# Altium project Desafio_Hardware_Firmware_Nathania.PrjPcb
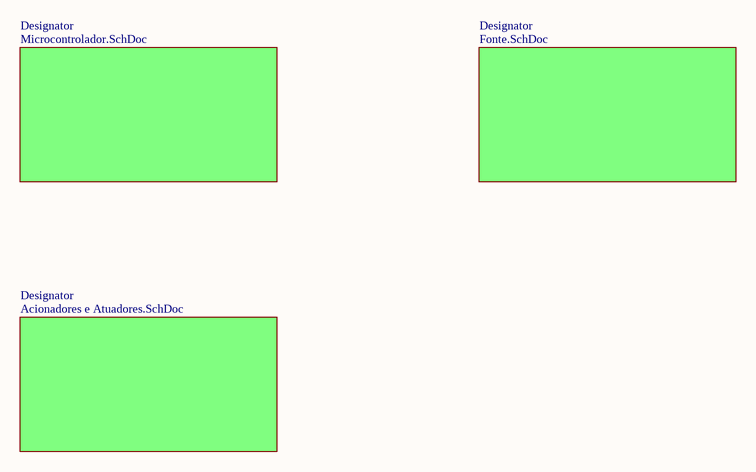
[diagram p0: Main.SchDoc]
4 sheets, 26 parts. Net scope: flat (ports and power ports of the same name join across sheets).
Board file: Desafio_Hardware_Firmware_Nathania.PcbDoc
Sheets:
  Main.SchDoc
    Designator = Microcontrolador.SchDoc
    Designator = Fonte.SchDoc
    Designator = Acionadores e Atuadores.SchDoc

## Sheet Main.SchDoc
size B

### Sub-sheets
Designator = Microcontrolador.SchDoc: no entries
Designator = Fonte.SchDoc: no entries
Designator = Acionadores e Atuadores.SchDoc: no entries

## Sheet Microcontrolador.SchDoc
size B
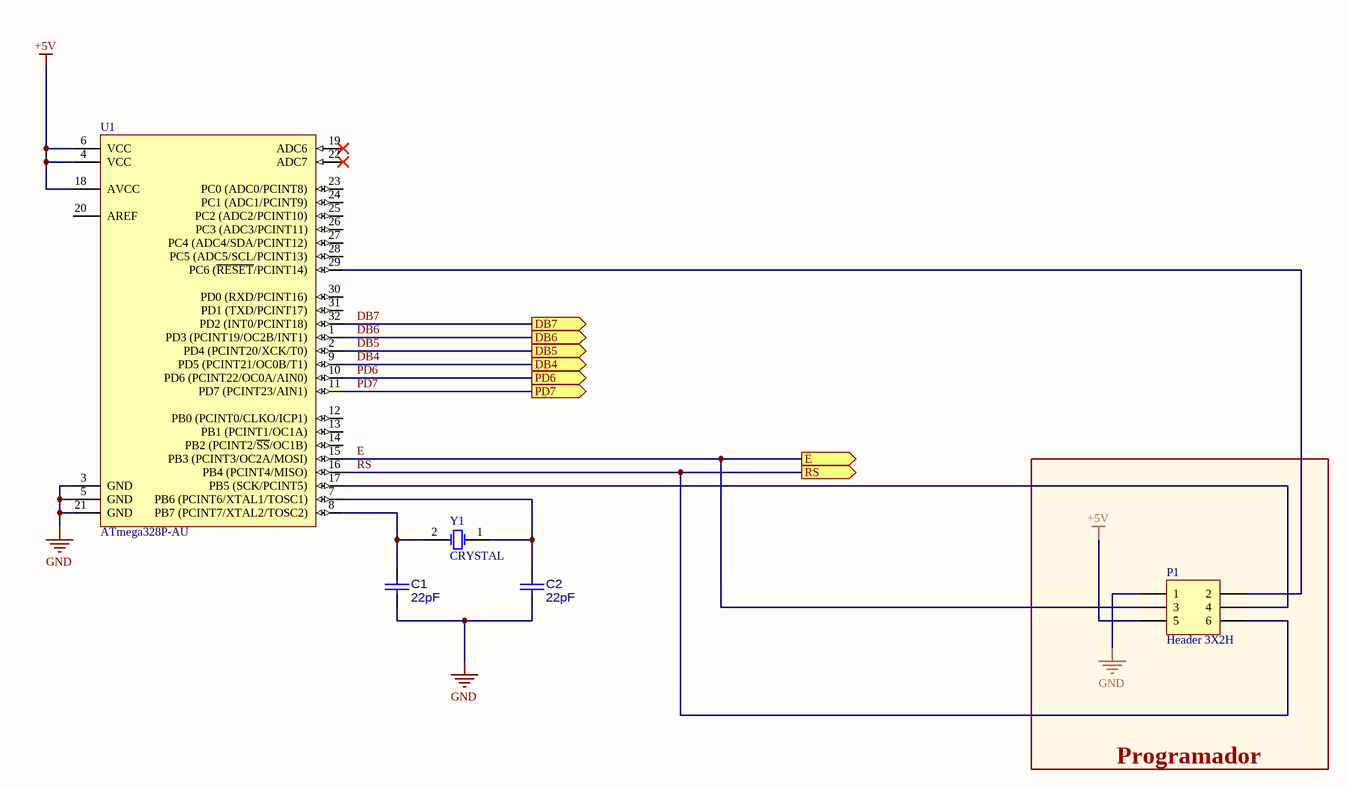
[diagram p1: Microcontrolador.SchDoc]

### Parts
C1  22pF  [CAP0805]
C2  22pF  [CAP0805]
P1  Header 3X2H  [HDR-2X3]
U1  ATmega328P-AU  [32A]
Y1  CRYSTAL  [HC49S-SMD]

### Blocks framed on the sheet
Programador: P1

### Ports
DB4 (out), DB5 (out), DB6 (out), DB7 (out), E (out), PD6 (out), PD7 (out), RS (out)

### Nets
+5V: P1.5 U1.4(VCC) U1.6(VCC) U1.18(AVCC)
GND: C1.2 C2.2 P1.1 U1.3(GND) U1.5(GND) U1.21(GND)
DB4: U1.9(PD5_(PCINT21/OC0B/T1)) ; port DB4
DB5: U1.2(PD4_(PCINT20/XCK/T0)) ; port DB5
DB6: U1.1(PD3_(PCINT19/OC2B/INT1)) ; port DB6
DB7: U1.32(PD2_(INT0/PCINT18)) ; port DB7
E: P1.3 U1.15(PB3_(PCINT3/OC2A/MOSI)) ; port E
PD6: U1.10(PD6_(PCINT22/OC0A/AIN0)) ; port PD6
PD7: U1.11(PD7_(PCINT23/AIN1)) ; port PD7
RS: P1.6 U1.16(PB4_(PCINT4/MISO)) ; port RS
NetC1_1: C1.1 U1.8(PB7_(PCINT7/XTAL2/TOSC2)) Y1.2(OSC2)
NetC2_1: C2.1 U1.7(PB6_(PCINT6/XTAL1/TOSC1)) Y1.1(OSC1)
NetP1_2: P1.2 U1.29(PC6_(~{RESET}/PCINT14))
NetP1_4: P1.4 U1.17(PB5_(SCK/PCINT5))

Not connected (* = marked no-connect by the designer): U1 12(PB0_(PCINT0/CLKO/ICP1)) 13(PB1_(PCINT1/OC1A)) 14(PB2_(PCINT2/~{SS}/OC1B)) 19(ADC6)* 20(AREF) 22(ADC7)* 23(PC0_(ADC0/PCINT8)) 24(PC1_(ADC1/PCINT9)) 25(PC2_(ADC2/PCINT10)) 26(PC3_(ADC3/PCINT11)) 27(PC4_(ADC4/SDA/PCINT12)) 28(PC5_(ADC5/SCL/PCINT13)) 30(PD0_(RXD/PCINT16)) 31(PD1_(TXD/PCINT17))

### Library data of the parts
C1 C2 = CAP_4: Footprint: 0805CAP; Digikey: 1276-1007-1-ND; Value: 22pF
P1 = Header 3X2H: Header, 3-Pin, Dual row, Right Angle; LatestRevisionDate: 17-Jul-2002; LatestRevisionNote: Re-released for DXP Platform.; Publisher: Altium Limited
U1 = ATmega328P-AU: 8-bit AVR Microcontroller, 32KB Flash, 1KB EEPROM, 2KB SRAM, 32-pin TQFP, Industrial Grade (-40°C to 85°C); Published: 1-Apr-2010; DatasheetVersion: revA, Jan-2010; PackageVersion: revB, Oct-2001; PackageReference: 32A; Publisher: Altium Limited; PackageDescription: 32-Lead, 7x7x1.0 mm Body, 0.8mm Lead Pitch, Thin Profile Plastic Quad Flat Package (TQFP); Supplier 1: Digi-Key; Supplier Part Number 1: ATMEGA328P-AU-ND; Supplier 2: Farnell; Supplier Part Number 2: 1715486; Supplier 3: Mouser; Supplier Part Number 3: 556-ATMEGA328P-AU; Code_JEDEC: MS-026-ABA; ComponentLink1Description: Manufacturer Link; ComponentLink1URL: http://www.atmel.com/products/avr/default.asp?; ComponentLink2Description: ATmega48A/48PA/88A/88PA/168A/168PA/328/328P Datasheet; ComponentLink2URL: http://www.atmel.com/dyn/resources/prod_documents/8271.pdf; ComponentLink3Description: ATmega48A/48PA/88A/88PA/168A/168PA/328/328P Summary; ComponentLink3URL: http://www.atmel.com/dyn/resources/prod_documents/8271S.pdf; ComponentLink4Description: Atmel.com Home; ComponentLink4URL: http://www.atmel.com
Y1 = CRYSTAL: Crystal Oscillator

## Sheet Fonte.SchDoc
size B
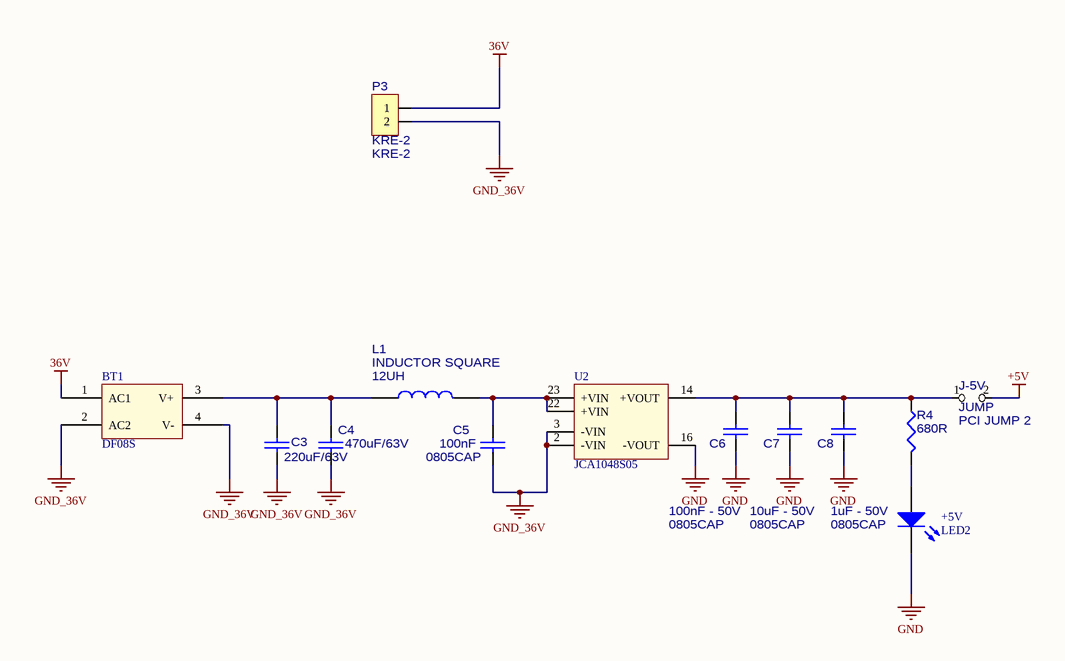
[diagram p2: Fonte.SchDoc]

### Parts
+5V  LED2  [3.2X1.6X1.1]
BT1  DF08S  [DF-S]
C3  220uF/63V  [CAP_ELET_SMD_10x13.5]
C4  470uF/63V  [CAP_ELET_SMD_10x13.5]
C5  Footprint: 0805CAP  [CAP0805]  (hidden comment: 100nF)
C6  Footprint: 0805CAP  [CAP0805]  (hidden comment: 100nF - 50V)
C7  Footprint: 0805CAP  [CAP0805]  (hidden comment: 10uF - 50V)
C8  Footprint: 0805CAP  [CAP0805]  (hidden comment: 1uF - 50V)
J-5V  Footprint: PCI JUMP 2  [JUMP2_0805]  (hidden comment: JUMP)
L1  value 12UH  Footprint: INDUCTOR SQUARE  [IND 61X61]  (hidden comment: 470UH)
P3  KRE-2  [KRE-2]
R4  680R  [0805RES]
U2  JCA1048S05  [SCW05]

### Nets
36V: BT1.1(AC1) P3.1
+5V: J-5V.2
GND: +5V.2(K) C6.2 C7.2 C8.2 U2.16(-VOUT)
GND_36V: BT1.2(AC2) BT1.4(V-) C3.1 C4.1 C5.2 P3.2 U2.2(-VIN) U2.3(-VIN)
Net+5V_1: +5V.1(A) R4.2
NetBT1_3: BT1.3(V+) C3.2 C4.2 L1.1
NetC5_1: C5.1 L1.2 U2.22(+VIN) U2.23(+VIN)
NetC6_1: C6.1 C7.1 C8.1 J-5V.1 R4.1 U2.14(+VOUT)

Not connected (* = marked no-connect by the designer): U2 9(NC) 11(NC)

### Library data of the parts
+5V = LED2: Typical RED, GREEN, YELLOW, AMBER GaAs LED; Published: 8-Jun-2000; LatestRevisionDate: 17-Jul-2002; LatestRevisionNote: Re-released for DXP Platform.; PackageVersion: Feb-2002; PackageReference: 3.2X1.6X1.1; Publisher: Altium Limited; PackageDescription: SM LED; 2 Flat Leads
C3-C8 = CAP
  C3: Value: 220uF/63V; Digikey: UWT1V221MNL1GS
  C4: Value: 470uF/63V; Footprint: 0805CAP; Digikey: UCL1V471MNL1GS
  C5: Value: 100nF; Digikey: 1276-1007-1-ND
  C6: Value: 100nF - 50V; Digikey: 1276-1007-1-ND
  C7: Value: 10uF - 50V; Digikey: 1276-1007-1-ND
  C8: Value: 1uF - 50V; Digikey: 1276-1007-1-ND
J-5V = JUMP: Class: DDR2_2_4; ClassName: FONTE_3V3; Value: JUMP
L1 = IND: Inductor; Digikey: SRR1280-471KLCT-ND
P3 = CON2_2_2: ClassName: Fonte2; ClassName: RELAY; Value: KRE-2
R4 = Res0805: 2.2 Ohm 5% 1/16W 0603 RES SMT; Value: 680R
U2 = SCW05

## Sheet Acionadores e Atuadores.SchDoc
size B
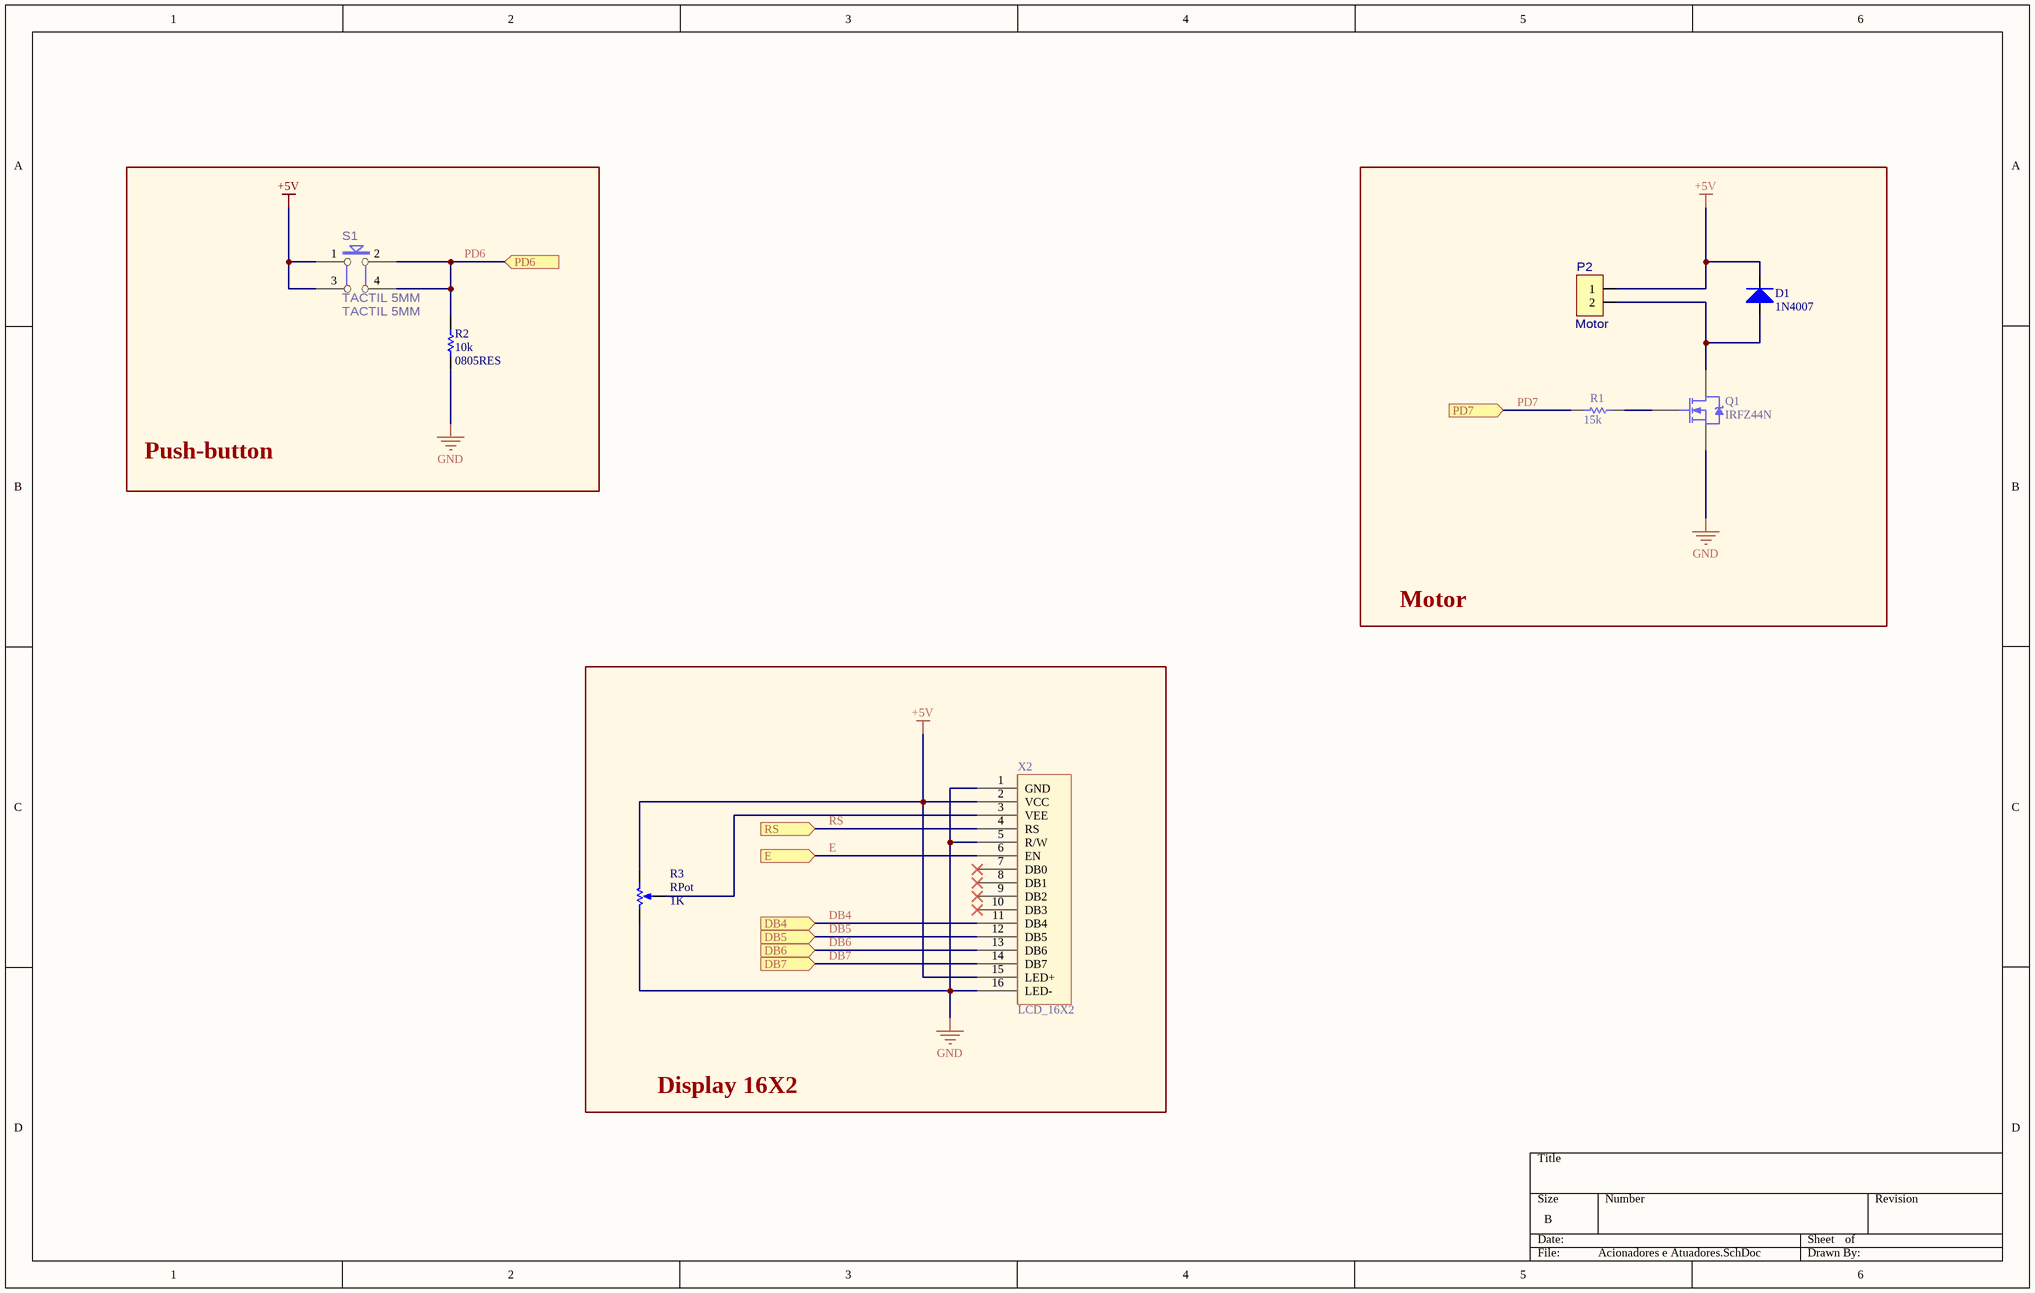
[diagram p3: Acionadores e Atuadores.SchDoc]

### Parts
D1  1N4007  [SOD123 - duplicate]
P2  Footprint: Motor  [KRE-2]  (hidden comment: KRE-2)
Q1  IRFZ44N  [D2PAK_N]
R1  15k  [0805RES]
R2  10k  [0805RES]
R3  RPot  value 1K  [Pot]
S1  TACTIL 5MM  [TACTIL 5MM - duplicate]
X2  LCD_16X2  [LCD16X2]

### Blocks framed on the sheet
Push-button: R2 S1
Motor: D1 P2 Q1 R1
Display 16X2: R3 X2

### Ports
DB4 (in), DB5 (in), DB6 (in), DB7 (in), E (in), PD6 (in), PD7 (in), RS (in)

### Nets
+5V: D1.2(K) P2.1 R3.1(TOP) S1.1 S1.3 X2.2(VCC) X2.15(LED+)
GND: Q1.3(S) R2.1 R3.2(BOT) X2.1(GND) X2.5(R/W) X2.16(LED-)
DB4: X2.11(DB4) ; port DB4
DB5: X2.12(DB5) ; port DB5
DB6: X2.13(DB6) ; port DB6
DB7: X2.14(DB7) ; port DB7
E: X2.6(EN) ; port E
PD6: R2.2 S1.2 S1.4 ; port PD6
PD7: R1.1 ; port PD7
RS: X2.4(RS) ; port RS
NetD1_1: D1.1(A) P2.2 Q1.2(D)
NetQ1_1: Q1.1(G) R1.2
NetR3_3: R3.3(TAP) X2.3(VEE)

Not connected (* = marked no-connect by the designer): X2 7(DB0)* 8(DB1)* 9(DB2)* 10(DB3)*

### Library data of the parts
D1 = Diode: Default Diode
P2 = CON2_2_2: ClassName: Fonte2; ClassName: RELAY; Value: KRE-2
Q1 = IRF640S: HEXFET N-Channel Power MOSFET; PackageReference: D2PAK; Publisher: Altium Limited; ComponentLink1Description: Manufacturer Link; ComponentLink2Description: Datasheet
R1 R2 = Res1: Resistor
  R1: Value: 15k
  R2: Value: 10k
R3 = RPot: Potentiometer; Sim Note: Enter the Resistance value and the set point into parameter fields.; Set Position: 0.5; Published: 8-Jun-2000; LatestRevisionDate: 17-Jul-2002; LatestRevisionNote: Re-released for DXP Platform.; PackageReference: VR5; Publisher: Altium Limited; PackageDescription: Variable Resistor, Thru-Hole; 3 Leads
S1 = PUSH-BUTTON: ClassName: PUSH_BUTTON; Value: TACTIL 5MM; Footprint: TACTIL 5MM

## Nets that join several sheets
+5V: Microcontrolador (P1.5 U1.4 U1.6 U1.18), Fonte (J-5V.2), Acionadores e Atuadores (7 pins)
GND: Microcontrolador (6 pins), Fonte (5 pins), Acionadores e Atuadores (6 pins)
DB4: Microcontrolador (U1.9), Acionadores e Atuadores (X2.11)
DB5: Microcontrolador (U1.2), Acionadores e Atuadores (X2.12)
DB6: Microcontrolador (U1.1), Acionadores e Atuadores (X2.13)
DB7: Microcontrolador (U1.32), Acionadores e Atuadores (X2.14)
E: Microcontrolador (P1.3 U1.15), Acionadores e Atuadores (X2.6)
PD6: Microcontrolador (U1.10), Acionadores e Atuadores (R2.2 S1.2 S1.4)
PD7: Microcontrolador (U1.11), Acionadores e Atuadores (R1.1)
RS: Microcontrolador (P1.6 U1.16), Acionadores e Atuadores (X2.4)